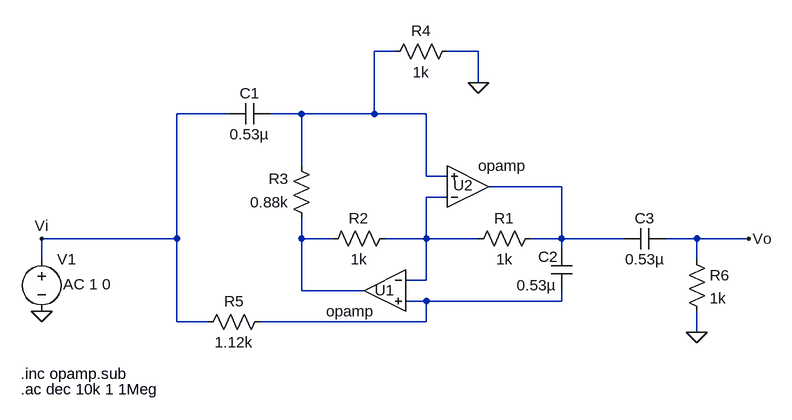
[diagram p0: schematic Circuito.asc]
Circuito.asc, the LTspice schematic file:
Version 4
SHEET 1 880 680
WIRE 160 -112 128 -112
WIRE 288 -112 240 -112
WIRE 288 -64 288 -112
WIRE -96 -16 -176 -16
WIRE 16 -16 -32 -16
WIRE 128 -16 128 -112
WIRE 128 -16 16 -16
WIRE 208 -16 128 -16
WIRE 16 64 16 -16
WIRE 208 80 208 -16
WIRE 240 80 208 80
WIRE 416 96 304 96
WIRE 240 112 208 112
WIRE -176 176 -176 -16
WIRE -176 176 -384 176
WIRE 16 176 16 144
WIRE 64 176 16 176
WIRE 208 176 208 112
WIRE 208 176 144 176
WIRE 288 176 208 176
WIRE 416 176 416 96
WIRE 416 176 368 176
WIRE 512 176 416 176
WIRE 624 176 576 176
WIRE 704 176 624 176
WIRE 416 192 416 176
WIRE -384 208 -384 176
WIRE 624 208 624 176
WIRE 208 240 208 176
WIRE 208 240 176 240
WIRE 16 256 16 176
WIRE 112 256 16 256
WIRE 208 272 176 272
WIRE 416 272 416 256
WIRE 416 272 208 272
WIRE -176 304 -176 176
WIRE -128 304 -176 304
WIRE 208 304 208 272
WIRE 208 304 -48 304
WIRE 624 320 624 288
FLAG 288 -64 0
FLAG -384 288 0
FLAG -384 176 Vi
FLAG 704 176 Vo
FLAG 624 320 0
SYMBOL OpAmps\\opamp 144 192 M0
WINDOW 0 -15 63 Left 2
SYMATTR InstName U1
SYMBOL OpAmps\\opamp 272 160 M180
WINDOW 0 -23 66 Left 2
SYMATTR InstName U2
SYMBOL res 384 160 R90
WINDOW 0 0 56 VBottom 2
WINDOW 3 32 56 VTop 2
SYMATTR InstName R1
SYMATTR Value 1k
SYMBOL res 160 160 R90
WINDOW 0 0 56 VBottom 2
WINDOW 3 32 56 VTop 2
SYMATTR InstName R2
SYMATTR Value 1k
SYMBOL res 32 160 R180
WINDOW 0 36 76 Left 2
WINDOW 3 36 40 Left 2
SYMATTR InstName R3
SYMATTR Value 0.88k
SYMBOL res 144 -96 R270
WINDOW 0 32 56 VTop 2
WINDOW 3 0 56 VBottom 2
SYMATTR InstName R4
SYMATTR Value 1k
SYMBOL cap -32 -32 R90
WINDOW 0 0 32 VBottom 2
WINDOW 3 32 32 VTop 2
SYMATTR InstName C1
SYMATTR Value 0.53µ
SYMBOL res -32 288 R90
WINDOW 0 0 56 VBottom 2
WINDOW 3 32 56 VTop 2
SYMATTR InstName R5
SYMATTR Value 1.12k
SYMBOL cap 432 256 R180
WINDOW 0 21 52 Left 2
WINDOW 3 24 8 Left 2
SYMATTR InstName C2
SYMATTR Value 0.53µ
SYMBOL voltage -384 192 R0
WINDOW 123 33 54 Left 2
WINDOW 39 0 0 Left 0
SYMATTR Value2 AC 1 0
SYMATTR InstName V1
SYMATTR Value ""
SYMBOL cap 576 160 R90
WINDOW 0 0 32 VBottom 2
WINDOW 3 32 32 VTop 2
SYMATTR InstName C3
SYMATTR Value 0.53µ
SYMBOL res 608 192 R0
SYMATTR InstName R6
SYMATTR Value 1k
TEXT -416 384 Left 2 !.inc opamp.sub
TEXT -416 408 Left 2 !.ac dec 10k 1 1Meg

The netlist it stands for:
* Circuito.asc
XU1 N003 N005 N004 opamp Aol=100K GBW=10Meg  ; pins invin noninvin out
XU2 N003 N001 N002 opamp Aol=100K GBW=10Meg  ; pins invin noninvin out
R1 N002 N003 1k
R2 N003 N004 1k
R3 N004 N001 0.88k
R4 N001 0 1k
C1 N001 Vi 0.53µ
R5 N005 Vi 1.12k
C2 N005 N002 0.53µ
V1 Vi 0 AC 1 0
C3 Vo N002 0.53µ
R6 Vo 0 1k
.inc opamp.sub
.ac dec 10k 1 1Meg
.backanno
.end